# EAGLE board General IO (EAGLE 7.4.0)
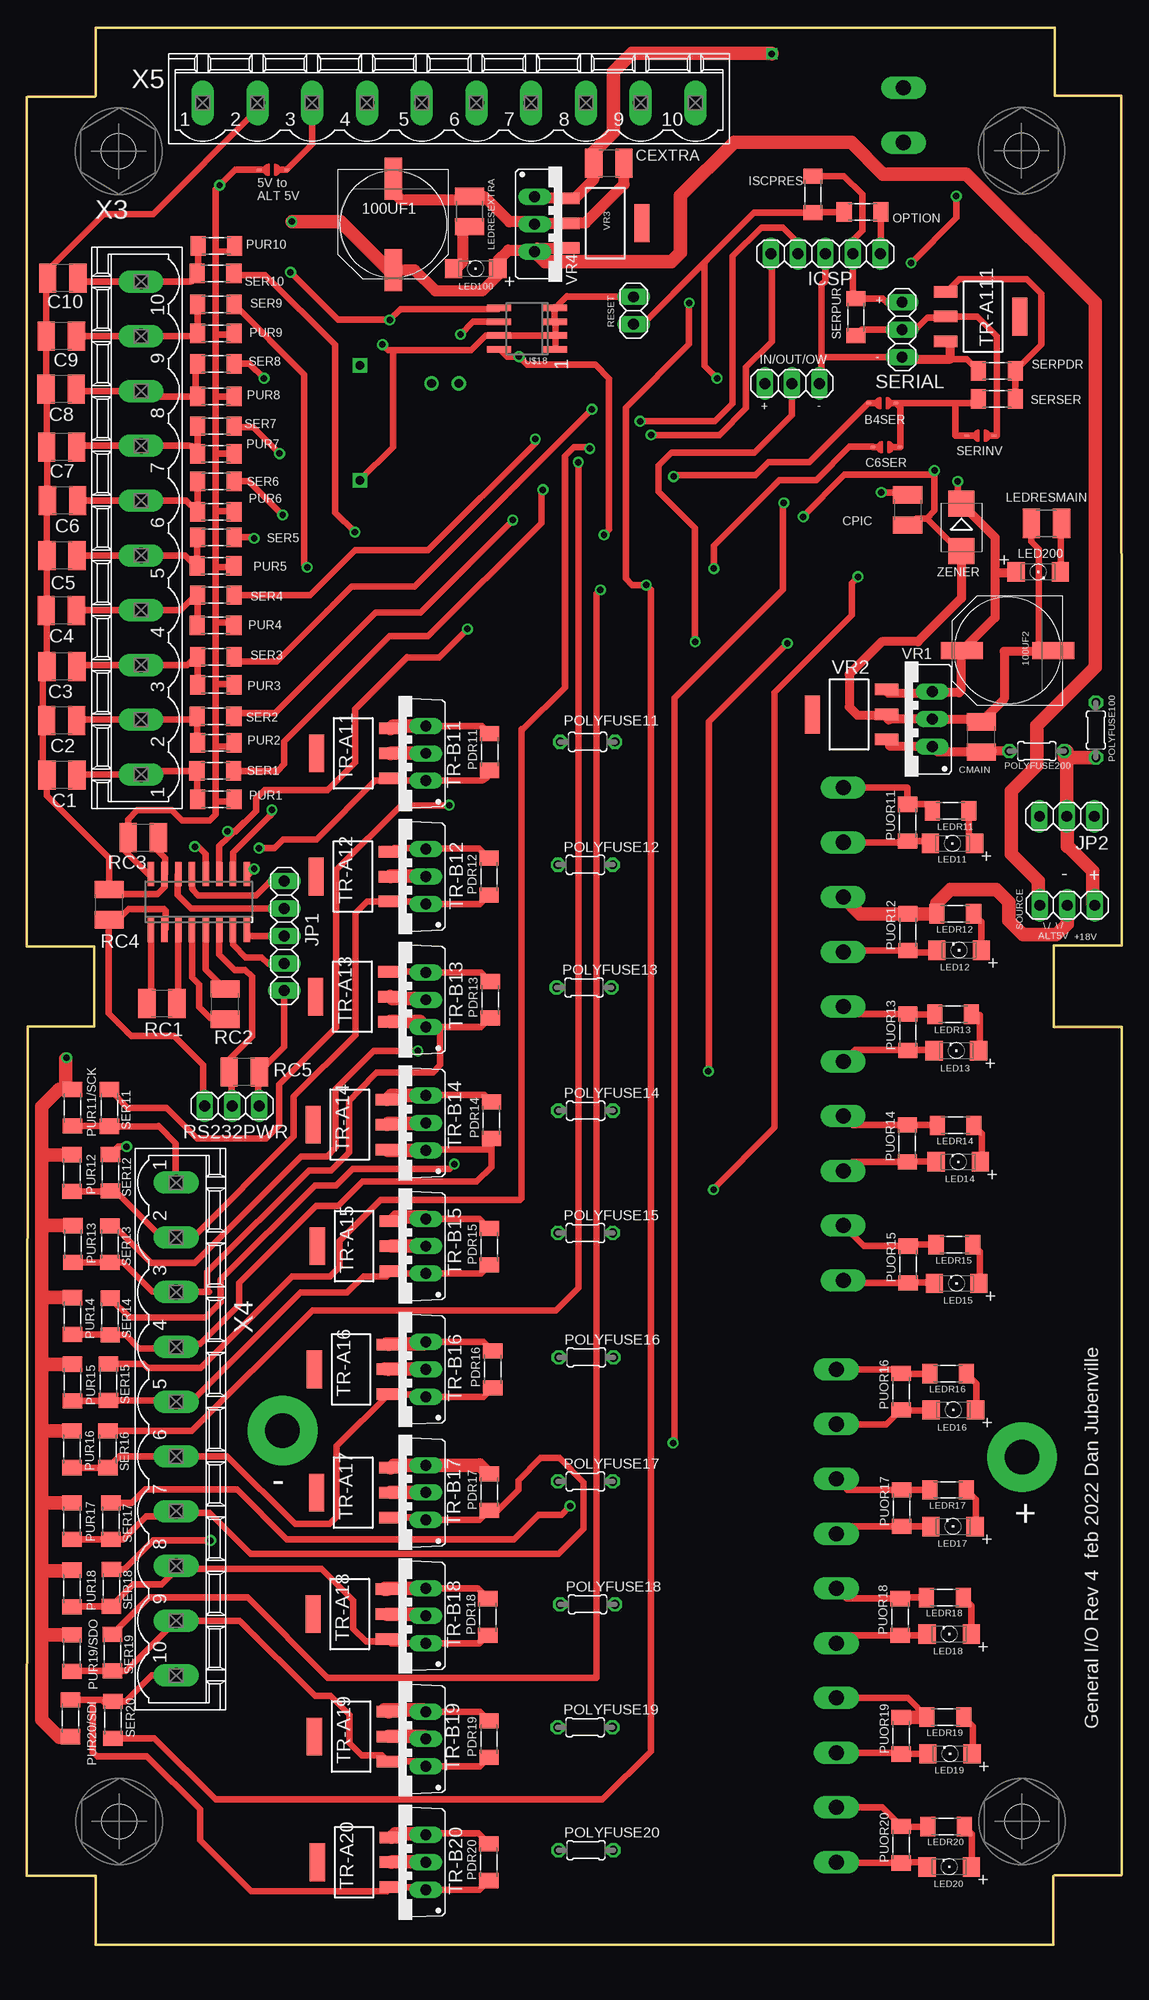
[diagram p1: board, top side]
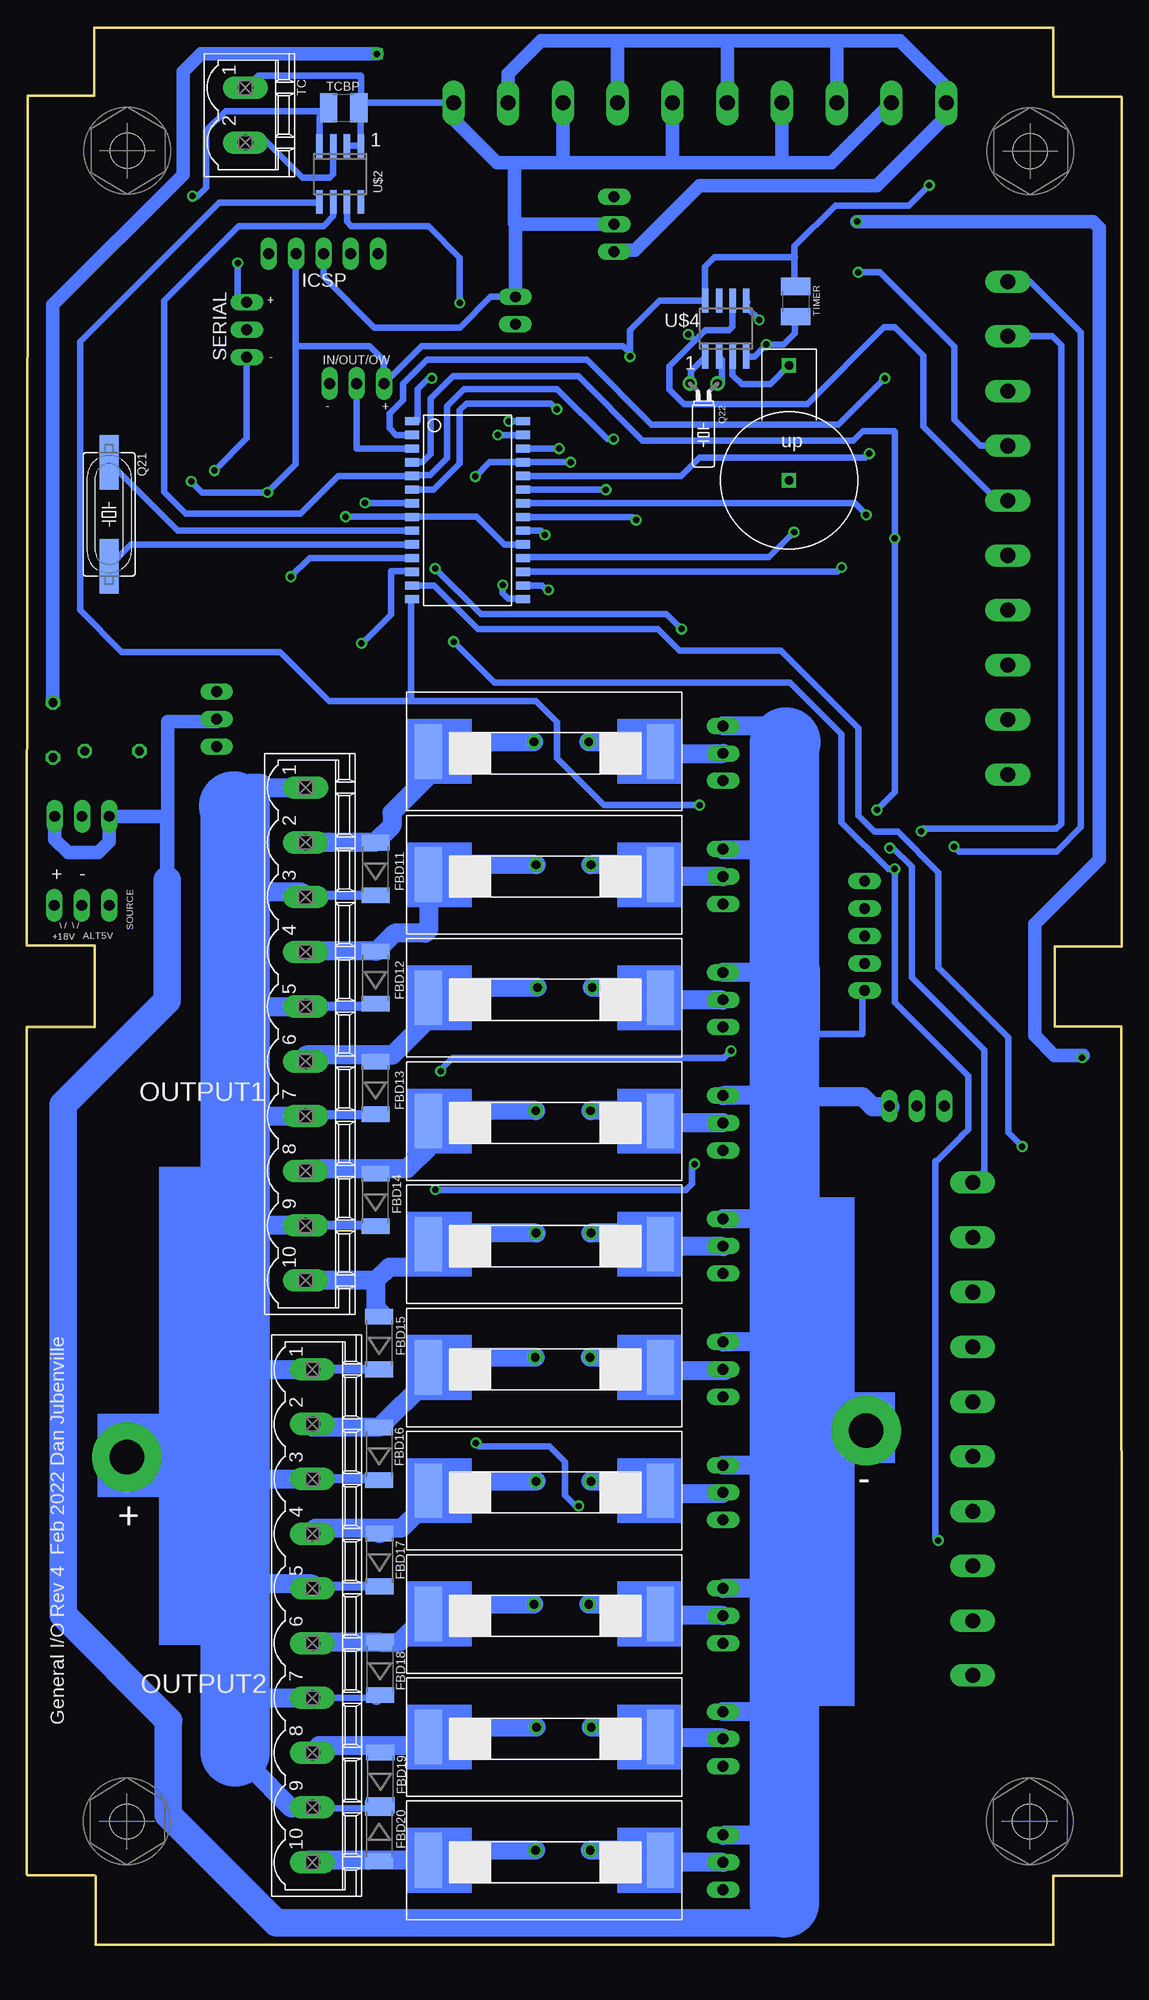
[diagram p2: board, bottom side, seen from below]

Size 101.6 x 177.83 mm. Coordinates in mm from the lower left corner, seen from the top.
Outline: 6.38,0 6.38,6.38 0,6.38 0.08,85.17 6.25,85.17 6.25,92.61 0,92.61 0,171.37 0.08,171.45 6.3,171.45 6.38,171.53 6.38,177.82 95.38,177.82 95.38,171.68 95.35,171.53 101.52,171.53 101.55,165.43 101.6,92.71 95.3,92.71 95.3,85.11 101.6,85.11 101.6,6.53 101.55,6.45 95.35,6.45 95.22,6.33 95.22,0 6.4,0
Copper layers (1*16): Top 0.035mm / dielectric 1.5mm / Bottom 0.035mm
Design rules "default *": minimum track width 15mil, minimum drill 20mil, track to track 15mil, track to pad 15mil, pad to pad 15mil, via to via 15mil, smd to smd 0mil, copper to edge 5mil, drill to drill 5mil, minimum pad ring 10mil, minimum via ring 8mil, stop-mask expansion 4mil, vias tented up to drill 0mil, thermal gap 10mil

## Footprints (pad centres in the part's own frame; a part is rotated, then mirrored left to right if it is on the bottom)
PANASONIC_G = smd 3.9 x 1.6: + 4.25,0; - -4.25,0
BH-401 = drill 0.8 square: P$1 0,0; P$2 0,10.668
C1210 = smd 1.6 x 2.7: 1 -1.4,0; 2 1.4,0
SPLIT_PAD = smd 0.406 x 0.203: P$1 0,0; P$2 2.54,0
SOD87 = smd 1.45 x 2.6: 1 -2.445,0; 2 2.445,0
FUSE = smd 2.54 x 5.08: P$1 2,5.54; P$2 23.54,5.54
SO-28W = smd 0.762 x 1.27: 1 -7.62,-5.207; 2 -6.35,-5.207; 3 -5.08,-5.207; 4 -3.81,-5.207; 5 -2.54,-5.207; 6 -1.27,-5.207; 7 0,-5.207; 8 1.27,-5.207; 9 2.54,-5.207; 10 3.81,-5.207; 11 5.08,-5.207; 12 6.35,-5.207; 13 7.62,-5.207; 14 8.89,-5.207; 15 8.89,5.08; 16 7.62,5.08; 17 6.35,5.08; 18 5.08,5.08; 19 3.81,5.08; 20 2.54,5.08; 21 1.27,5.08; 22 0,5.08; 23 -1.27,5.08; 24 -2.54,5.08; 25 -3.81,5.08; 26 -5.08,5.08; 27 -6.35,5.08; 28 -7.62,5.08
1X05 = drill 1.016 long: 1 -5.08,0; 2 -2.54,0; 3 0,0; 4 2.54,0; 5 5.08,0
1X03 = drill 1.016 long: 1 -2.54,0; 2 0,0; 3 2.54,0
M1406 = smd 1.4 x 1.8: 1 -1.7,0; 2 1.7,0
1206 = smd 1.6 x 1.803: + -1.422,0; - 2.692,0
R1210 = smd 1.6 x 2.7: 1 -1.4,0; 2 1.4,0
MSTBV10 = drill 1.397 long: 1 -22.86,0; 2 -17.78,0; 3 -12.7,0; 4 -7.62,0; 5 -2.54,0; 6 2.54,0; 7 7.62,0; 8 12.7,0; 9 17.78,0; 10 22.86,0
0204/5 = drill 0.813 octagon: 1 -2.54,0; 2 2.54,0
SM49 = smd 5.08 x 1.778: 1 -4.826,0; 2 4.826,0
TC26H = drill 0.813: 1 -1.27,0; 2 1.27,0
1X02 = drill 1.016 long: 1 -1.27,0; 2 1.27,0
MSTBV2 = drill 1.397 long: 1 -2.54,0; 2 2.54,0
SOT223R_INFINEON = smd 1.067 x 2.184: 1 -2.311,-3.479; 2 0,-3.48; 3 2.312,-3.48 | smd 3.5 x 1.4: 4 0,3.404
TO220BV = drill 1.016 long: D 0,-2.54; G -2.54,-2.54; S 2.54,-2.54
SO16 = smd 0.6 x 2.2: 1 -4.445,-2.6; 2 -3.175,-2.6; 3 -1.905,-2.6; 4 -0.635,-2.6; 5 0.635,-2.6; 6 1.905,-2.6; 7 3.175,-2.6; 8 4.445,-2.6; 9 4.445,2.6; 10 3.175,2.6; 11 1.905,2.6; 12 0.635,2.6; 13 -0.635,2.6; 14 -1.905,2.6; 15 -3.175,2.6; 16 -4.445,2.6
SO08 = smd 0.6 x 2.2: 1 -1.905,-2.6; 2 -0.635,-2.6; 3 0.635,-2.6; 4 1.905,-2.6; 5 1.905,2.6; 6 0.635,2.6; 7 -0.635,2.6; 8 -1.905,2.6
SCREW = hole 3.2: 0,0
TO220S = drill 1.016 long: 1 -2.54,-2.54; 2 0,-2.54; 3 2.54,-2.54
SMB = smd 2.4 x 2.4: A 2.2,0; C -2.2,0

## Placement (x,y rotation side)
100UF1  Extra power  [PANASONIC_G]  33.99,159.59 270 top
100UF2  Main Power  [PANASONIC_G]  90.98,120.04 180 top
BAT1  BH-401  [BH-401]  30.89,146.51 180 bottom
C1  [C1210]  3.25,108.51 180 top
C2  [C1210]  3.23,113.56 180 top
C3  [C1210]  3.25,118.57 180 top
C4  [C1210]  3.2,123.75 180 top
C5  [C1210]  3.25,128.85 180 top
C6  [C1210]  3.3,133.96 180 top
C6SER  SPLIT_PAD  [SPLIT_PAD]  78.49,138.91 0 top
C7  [C1210]  3.23,138.91 180 top
C8  [C1210]  3.17,144.3 180 top
C9  [C1210]  3.2,149.22 180 top
C10  [C1210]  3.33,154.58 180 top
CEXTRA  .1uf Extra power  [C1210]  54,165.28 0 top
CMAIN  .1uf main  [C1210]  88.54,112.04 90 top
CPIC  .1uf PIC Bypass  [C1210]  81.71,133.1 270 top
FBD11  [SOD87]  69.27,99.8 90 bottom
FBD12  [SOD87]  69.27,89.71 90 bottom
FBD13  [SOD87]  69.27,79.48 90 bottom
FBD14  [SOD87]  69.27,69.09 90 bottom
FBD15  [SOD87]  68.91,55.8 90 bottom
FBD16  [SOD87]  68.91,45.54 90 bottom
FBD17  [SOD87]  68.88,35.69 90 bottom
FBD18  [SOD87]  68.83,25.6 90 bottom
FBD19  [SOD87]  68.81,15.37 90 bottom
FBD20  [SOD87]  68.91,10.21 270 bottom
FUSE9  FUSE(SM)  [FUSE]  40.82,24.79 180 bottom
FUSE11  FUSE(SM)  [FUSE]  40.82,116.23 180 bottom
FUSE12  FUSE(SM)  [FUSE]  40.82,104.8 180 bottom
FUSE13  FUSE(SM)  [FUSE]  40.82,93.37 180 bottom
FUSE14  FUSE(SM)  [FUSE]  40.82,81.94 180 bottom
FUSE15  FUSE(SM)  [FUSE]  40.82,70.51 180 bottom
FUSE16  FUSE(SM)  [FUSE]  40.82,59.08 180 bottom
FUSE17  FUSE(SM)  [FUSE]  40.82,47.65 180 bottom
FUSE18  FUSE(SM)  [FUSE]  40.82,36.22 180 bottom
FUSE20  FUSE(SM)  [FUSE]  40.82,13.36 180 bottom
IC1  PIC18F2580  [SO-28W]  60.66,133.71 270 bottom
ICSP  [1X05]  74.09,156.87 180 top
IN/OUT/OW  [1X03]  70.99,144.83 180 top
ISCPRES  10k  [M1406]  72.92,162.36 90 top
JP1  [1X05]  23.88,93.57 270 top
JP2  [1X03]  96.49,104.67 180 top
LED11  [1206]  86.51,102.16 180 top
LED12  [1206]  87.12,92.25 180 top
LED13  [1206]  86.87,82.93 180 top
LED14  [1206]  87.05,72.62 180 top
LED15  [1206]  86.89,61.34 180 top
LED16  [1206]  86.59,49.61 180 top
LED17  [1206]  86.56,38.79 180 top
LED18  [1206]  86.21,28.8 180 top
LED19  [1206]  86.28,17.7 180 top
LED20  [1206]  86.21,7.21 180 top
LED100  Extra Power  [1206]  42.27,155.47 180 top
LED200  Main power  [1206]  93.19,127.36 0 top
LEDR11  [M1406]  85.7,105.18 180 top
LEDR12  [M1406]  86.13,95.63 180 top
LEDR13  [M1406]  85.93,86.31 180 top
LEDR14  [M1406]  86.16,76 180 top
LEDR15  [M1406]  86.06,64.92 180 top
LEDR16  [M1406]  85.47,52.98 180 top
LEDR17  [M1406]  85.47,42.19 180 top
LEDR18  [M1406]  85.17,32.21 180 top
LEDR19  [M1406]  85.22,21.11 180 top
LEDR20  [M1406]  85.29,10.97 180 top
LEDRESEXTRA  [R1210]  41.07,160.78 90 top
LEDRESMAIN  [R1210]  94.59,131.85 180 top
OPTION  470  [M1406]  77.52,160.73 0 top
OUTPUT1  MSTBV10  [MSTBV10]  75.74,84.48 270 bottom
OUTPUT2  MSTBV10  [MSTBV10]  75.11,30.51 270 bottom
PDR11  [M1406]  42.93,110.64 90 top
PDR12  [M1406]  42.88,99.09 90 top
PDR13  [M1406]  42.98,87.66 90 top
PDR14  [M1406]  43.1,76.48 90 top
PDR15  [M1406]  42.9,64.74 90 top
PDR16  [M1406]  43.21,53.37 90 top
PDR17  [M1406]  42.9,41.99 90 top
PDR18  [M1406]  42.77,30.4 90 top
PDR19  [M1406]  42.88,19.08 90 top
PDR20  [M1406]  42.85,7.65 90 top
POLYFUSE11  [0204/5]  52.02,111.58 0 top
POLYFUSE12  [0204/5]  51.82,100.18 0 top
POLYFUSE13  [0204/5]  51.69,88.8 0 top
POLYFUSE14  [0204/5]  51.84,77.37 0 top
POLYFUSE15  [0204/5]  51.82,66.01 0 top
POLYFUSE16  [0204/5]  51.89,54.48 0 top
POLYFUSE17  [0204/5]  51.82,42.98 0 top
POLYFUSE18  [0204/5]  52.02,31.57 0 top
POLYFUSE19  [0204/5]  51.79,20.17 0 top
POLYFUSE20  [0204/5]  51.87,8.76 0 top
POLYFUSE100  Extra Power  [0204/5]  99.19,112.67 90 top
POLYFUSE200  Main power  [0204/5]  93.7,110.72 180 top
PUOR11  [M1406]  81.71,104.09 90 top
PUOR12  [M1406]  81.74,93.93 90 top
PUOR13  [M1406]  81.74,84.63 90 top
PUOR14  [M1406]  81.69,74.32 90 top
PUOR15  [M1406]  81.76,63.09 90 top
PUOR16  [M1406]  81.1,51.31 90 top
PUOR17  [M1406]  81.15,40.49 90 top
PUOR18  [M1406]  81,30.4 90 top
PUOR19  [M1406]  81.13,19.38 90 top
PUOR20  [M1406]  81.13,9.27 90 top
PUR1  [M1406]  17.53,106.25 180 top
PUR2  [M1406]  17.53,111.48 180 top
PUR3  [M1406]  17.53,116.87 180 top
PUR4  [M1406]  17.5,122.38 180 top
PUR5  [M1406]  17.5,127.89 180 top
PUR6  [M1406]  17.53,132.92 180 top
PUR7  [M1406]  17.53,138.3 180 top
PUR8  [M1406]  17.53,143.61 0 top
PUR9  [M1406]  17.53,149.48 180 top
PUR10  [M1406]  17.58,157.58 180 top
PUR11/SCK  [M1406]  4.22,77.65 270 top
PUR12  [M1406]  4.19,71.58 270 top
PUR13  [M1406]  4.27,65 270 top
PUR14  [M1406]  4.24,58.32 270 top
PUR15  [M1406]  4.22,52.15 90 top
PUR16  [M1406]  4.19,45.95 90 top
PUR17  [M1406]  4.19,39.29 90 top
PUR18  [M1406]  4.17,33.05 90 top
PUR19/SDO  [M1406]  4.17,27.05 90 top
PUR20/SDI  [M1406]  4.04,21.01 270 top
Q21  20MHz  [SM49]  93.98,132.69 270 bottom
Q22  32.768kHz  [TC26H]  38.81,144.83 180 bottom
RC1  [C1210]  12.52,87.33 0 top
RC2  [C1210]  18.39,87.25 90 top
RC3  [C1210]  10.79,102.72 0 top
RC4  [C1210]  7.62,96.47 90 top
RC5  [C1210]  20.17,80.95 180 top
RESET  [1X02]  56.29,151.59 270 top
RS232PWR  [1X03]  19.02,77.8 180 top
SER1  [M1406]  17.48,108.89 0 top
SER2  [M1406]  17.5,113.94 0 top
SER3  [M1406]  17.53,119.48 0 top
SER4  [M1406]  17.53,125.2 0 top
SER5  [M1406]  17.53,130.56 0 top
SER6  [M1406]  17.53,135.74 0 top
SER7  [M1406]  17.53,140.87 0 top
SER8  [M1406]  17.53,146.66 180 top
SER9  [M1406]  17.53,152.17 0 top
SER10  [M1406]  17.5,155.04 0 top
SER11  [M1406]  7.67,77.62 270 top
SER12  [M1406]  7.75,71.6 270 top
SER13  [M1406]  7.7,64.97 270 top
SER14  [M1406]  7.72,58.27 270 top
SER15  [M1406]  7.57,52.17 270 top
SER16  [M1406]  7.52,45.95 270 top
SER17  [M1406]  7.8,39.29 270 top
SER18  [M1406]  7.82,33.1 270 top
SER19  [M1406]  7.92,27.1 270 top
SER20  [M1406]  7.98,20.85 90 top
SERIAL  [1X03]  81.2,149.81 90 top
SERPDR  [M1406]  89.99,146 180 top
SERPUR  [M1406]  76.91,150.98 270 top
SERSER  [M1406]  89.99,143.38 0 top
SOURCE  [1X03]  96.52,96.42 0 top
TC  Type K  [MSTBV2]  81.33,169.72 270 bottom
TCBP  .1uf TC Bypass  [C1210]  72.21,170.41 0 bottom
TIMER  .1uf Timer Bypass  [C1210]  30.28,152.43 270 bottom
TR-A11  [SOT223R_INFINEON]  30.28,110.52 90 top
TR-A12  [SOT223R_INFINEON]  30.25,99.09 90 top
TR-A13  [SOT223R_INFINEON]  30.2,87.93 90 top
TR-A14  [SOT223R_INFINEON]  29.95,76.07 90 top
TR-A15  [SOT223R_INFINEON]  30.35,64.8 90 top
TR-A16  [SOT223R_INFINEON]  30.07,53.37 90 top
TR-A17  [SOT223R_INFINEON]  30.28,41.94 90 top
TR-A18  [SOT223R_INFINEON]  29.95,30.66 90 top
TR-A19  [SOT223R_INFINEON]  30.07,19.3 90 top
TR-A20  [SOT223R_INFINEON]  30.35,7.65 90 top
TR-A111  [SOT223R_INFINEON]  88.72,151.03 270 top
TR-B11  [TO220BV]  34.47,110.52 90 top
TR-B12  [TO220BV]  34.47,99.09 90 top
TR-B13  [TO220BV]  34.47,87.66 90 top
TR-B14  [TO220BV]  34.47,76.23 90 top
TR-B15  [TO220BV]  34.47,64.8 90 top
TR-B16  [TO220BV]  34.47,53.37 90 top
TR-B17  [TO220BV]  34.47,41.94 90 top
TR-B18  [TO220BV]  34.47,30.51 90 top
TR-B19  [TO220BV]  34.47,19.08 90 top
TR-B20  [TO220BV]  34.47,7.65 90 top
U$1  MAX232  [SO16]  15.95,96.72 0 top
U$2  MAX6674  [SO08]  72.54,164.26 180 bottom
U$4  M41T00TIMER-I2C  [SO08]  36.75,149.91 0 bottom
U$11  [SCREW]  8.56,11.43 0 top
U$13  [SCREW]  92.33,11.43 0 top
U$14  [SCREW]  92.28,166.42 0 top
U$15  [SCREW]  8.51,166.37 0 top
U$18  FM24C256  [SO08]  46.41,149.91 90 top
U$21  SPLIT_PAD  [SPLIT_PAD]  21.56,164.64 0 top
U$23  SPLIT_PAD  [SPLIT_PAD]  89.74,139.98 180 top
U$24  SPLIT_PAD  [SPLIT_PAD]  80.62,143 180 top
VR1  Main  [TO220S]  81.46,113.69 90 top
VR2  Main  [SOT223R_INFINEON]  76.28,114.12 90 top
VR3  Extra power  [SOT223R_INFINEON]  53.67,159.69 270 top
VR4  Extra power  [TO220S]  49.66,159.61 270 top
X3  Inputs 1  [MSTBV10]  10.59,131.42 90 top
X4  Inputs 2  [MSTBV10]  13.84,47.83 270 top
X5  Extra power  [MSTBV10]  39.17,170.87 0 top
ZENER  5.1V  [SMB]  86.71,131.48 270 top

## Tracks (layer width: path | path; a pad name or v marks a point on that pad's centre or on a via)
$N199  (via drill 0.6)
  Top 0.61: SER20.1 11.81,19.15 17.5,13.46 53.42,13.46 57.89,17.93 57.89,125.7 v57.45,126.14 56.16,126.14 55.58,126.72 55.58,142.6 61.44,148.46 v61.44,152.3
  Bottom 0.61: IC1.15 55.58,124.87 56.95,124.87 57.45,125.37 v57.45,126.14 | U$2.7 71.91,159.82 71.5,159.41 64.34,159.41 61.44,156.51 v61.44,152.3
+5V  (via drill 0.6)
  Top 0.61: U$18.8 43.84,148.01 44.53,147.32 v45.64,147.32 46.41,146.56 52.73,146.56 54.03,145.26 54.03,131.27 v53.54,130.78 | ZENER.C 86.36,134.03 v86.36,135.74 | 81.49,134.72 CPIC.1 81.64,134.57 81.64,134.7 79.3,134.7 v79.27,134.72 | 17.53,106.05 17.53,104.83 16.97,104.27 14.4,104.27 13.44,105.23 10.24,105.23 9.39,104.39 RC3.1 8.94,102.26 8.94,101.65 11.27,99.32 U$1.16 | 17.53,106.05 17.53,111.15 | 17.53,111.15 17.53,116.94 | 17.53,116.94 17.53,122.66 | 17.53,122.66 17.53,127.81 | 17.53,127.81 17.53,132.99 | 17.53,132.99 17.53,138.3 | 17.53,138.3 17.53,143.61 | 17.53,143.61 17.53,149.38 | 17.53,149.38 17.53,157.05 | 17.53,157.05 19.28,157.05 PUR10.1 | PUR2.1 18.9,111.15 17.53,111.15 | PUR3.1 19.15,116.94 17.53,116.94 | PUR4.1 18.92,122.66 17.53,122.66 | PUR5.1 19.12,127.81 17.53,127.81 | PUR6.1 19.15,132.99 17.53,132.99 | PUR7.1 17.53,138.3 | PUR8.2 17.53,143.61 | PUR9.1 19.12,149.38 17.53,149.38 | VR2.3 79.93,116.26 79.93,116.08 | PUR1.1 19.02,106.05 17.53,106.05 | v82.04,156.01 86.23,160.2 v86.23,162.2 | SERIAL.3 79.73,152.35 79.4,152.68 SERPUR.1 76.63,152.96 ICSP.2 76.73,156.97 76.73,158.22 77.5,158.98 77.5,162.38 75.82,164.06 ISCPRES.2 | 17.53,157.05 17.53,162.87 v17.88,163.22 19.3,164.64 21.95,164.64
  Top 0.813: 84.15,116.08 84.2,116.08 | 84.15,116.08 VR1.3 84.1,116.13 86.49,116.13 86.64,116.28 86.64,120.04 100UF2.+ 86.77,120.04 89.81,123.09 89.81,127.25 | 84.15,116.08 79.93,116.08 | ZENER.C 89.81,130.57 89.81,127.25 | LED200.+ 91.67,127.25 89.81,127.25
  Bottom 0.61: TIMER.1 30.36,153.75 30.38,153.75 30.38,156.59 | 30.38,156.59 30.33,156.54 37.8,156.54 38.68,155.65 38.68,152.54 U$4.8 42.93,152.5 45.67,149.76 45.67,147.29 | 55.6,131.14 IC1.20 53.92,131.17 v53.54,130.78 | 30.38,156.59 30.38,157.56 26.59,161.34 19.76,161.34 v17.88,163.22 | SERIAL.3 81.25,152.35 81.31,152.3 82.04,153.03 v82.04,156.01 | 45.67,147.29 45.67,147.24 | 45.67,147.29 v45.64,147.32 45.64,147.62 46.3,148.28 65,148.28 IN/OUT/OW.3 68.53,144.91 68.53,146.99 69.83,148.28 76.66,148.28 | v86.36,135.74 85.34,134.72 v79.27,134.72 79.3,134.7 79.3,134.72 76.66,137.36 76.66,148.28 | 76.66,148.28 76.66,156.84 ICSP.2 | 74.06,169.97 TCBP.1 | 74.06,169.97 74.19,170.1 83.16,170.1 84.96,168.3 84.96,162.99 85.75,162.2 v86.23,162.2 | U$2.4 74.45,169.57 74.06,169.97
+18V
  Top 1.27: 98.93,96.42 98.98,96.37 99.03,96.42 SOURCE.3 98.88,96.6 98.88,99.59 96.62,101.85 96.52,101.85 96.52,104.67 JP2.2 96.5,110.72 POLYFUSE200.1 96.24,110.13 POLYFUSE100.1
ALT5V  (via drill 0.6)
  Top 0.61: 37.9,153.42 37.9,153.47 35.89,155.47 33.48,155.47 | 1.37,28.68 1.45,28.75 | 1.37,34.75 1.22,34.75 1.22,34.74 | 1.37,41.05 1.42,41.05 1.48,40.99 | 1.37,47.68 1.4,47.65 | 1.37,53.9 1.35,53.9 1.4,53.85 | 1.37,60.02 1.42,60.02 | 1.37,66.7 1.42,66.7 | 1.37,73.3 1.42,73.3 1.45,73.28 | VR3.3 49,157.38 | U$21.P$2 26.47,167 X5.3
  Top 0.813: v3.68,82.27 3.58,82.17 | 3.58,79.53 3.76,79.35 PUR11/SCK.1
  Top 1.016: 49,157.38 47.37,157.38 47.12,157.12 VR4.3 47.17,157.07 47.22,157.12 47.14,157.2 44.68,157.2 43.69,156.21 LED100.+ 43.69,155.3 43.92,155.07 42.27,153.42 37.9,153.42 35.98,155.34 100UF1.+
  Top 1.27: 33.48,155.47 29.11,159.84 v24.59,159.84 | 1.37,34.67 1.37,28.68 1.37,20.85 3,19.23 3.96,19.23 PUR20/SDI.2 | 1.37,34.67 1.37,34.75 1.37,41.05 1.37,47.68 1.37,53.9 1.37,60.02 1.37,66.7 1.37,73.3 1.37,77.75 2.97,79.35 PUR11/SCK.1 | 1.45,28.75 PUR19/SDO.2 | 1.48,40.99 PUR17.2 | 1.4,47.65 PUR16.2 | 1.4,53.85 PUR15.2 | 1.42,60.02 PUR14.1 | 1.42,66.7 PUR13.1 | 1.45,73.28 PUR12.1 | SOURCE.1 93.85,96.55 93.85,98.65 91.31,101.19 91.31,107.01 93.7,109.4 93.7,113.11 99.11,118.52 99.11,152.32 87.17,164.26 79.43,164.26 76.48,167.21 65.63,167.21 60.66,162.23 60.66,156.97 59.82,156.13 48.06,156.13 VR4.3 | 3.58,82.17 3.58,79.53 | PUR18.2 4.09,34.67 1.37,34.67
  Bottom 0.61: 3.61,82.5 3.61,82.35 v3.68,82.27
  Bottom 1.27: 26.47,176.61 20.6,176.61 16.31,172.31 X5.1 16.26,170.87 16.2,170.81 16.2,169.72 | 26.47,176.61 36.6,176.61 | 36.6,176.61 46.79,176.61 | 46.79,176.61 53.92,176.61 56.97,173.56 56.97,170.84 | 56.97,170.84 56.97,170.69 | 56.97,170.84 X5.9 | 26.47,176.61 26.47,176.63 | 26.47,176.61 X5.3 | X5.5 36.6,170.89 36.6,176.61 | 46.79,176.61 46.79,176.63 | 46.79,176.61 X5.7 | 16.2,169.54 16.2,169.72 | v24.59,159.84 2.67,159.84 2.11,159.28 2.11,100.66 8.1,94.67 8.1,84.33 6.27,82.5 3.61,82.5 | VR4.3 46.99,157.2 45.19,157.2 39.22,163.17 22.76,163.17 16.2,169.72
GND  (via drill 0.6, 3.2 pad 6.45)
  Top 0.381: U$1.15 12.78,98.48
  Top 0.406: CPIC.2 81.92,131.7 82.3,132.08 | TR-A111.3 85.34,148.72 85.67,148.39
  Top 0.61: PDR14.2 42.44,78.84 36.93,78.84 | PDR12.2 41.96,101.7 41.93,101.68 36.96,101.68 | U$18.2 49.63,149.28 | U$18.2 U$18.7 42.55,149.28 41.2,147.93 33.96,147.93 | U$18.1 49.02,148.02 49.02,149.29 | 49.02,149.29 U$18.2 | 49.02,149.29 49.02,150.53 U$18.3 48.95,150.61 48.95,151.88 | 48.95,151.88 48.95,151.89 | 48.95,151.88 U$18.4 50.12,152.93 50.2,152.86 RESET.1 | 82.3,132.08 82.53,132.31 83.49,132.31 | 83.49,132.31 84.2,133.02 84.2,136.3 84.15,136.35 | 73.74,147.27 SERIAL.1 | 93.19,131.78 93.29,131.88 | 93.19,131.78 LEDRESMAIN.2 | 73.53,143.97 IN/OUT/OW.1 73.74,145.03 73.74,147.27 | 37.36,78.72 37.06,78.72 TR-B14.S 36.98,78.79 36.88,78.79 | TR-A14.3 33.76,78.72 | TR-B15.S 36.93,67.41 | 34.14,67.41 TR-A15.3 | 36.98,55.88 TR-B16.S 42.37,55.91 PDR16.2 | TR-A16.3 33.76,55.88 | 33.76,44.22 TR-A17.3 | TR-A17.3 | 36.75,44.22 TR-B17.S 37.06,44.53 | 33.35,21.69 33.48,21.69 TR-A19.3 | TR-B19.S 36.93,21.69 | 36.91,10.26 36.93,10.26 TR-B20.S | 36.83,21.59 36.98,21.59 TR-B19.S | 41.88,32.99 PDR18.2 | 42.01,44.53 42.06,44.48 | 36.7,67.28 36.96,67.28 TR-B15.S | TR-B13.S 36.73,90.19 | PDR13.2 42.14,90.19 TR-B13.S | TR-A12.3 34.06,101.73 37.11,101.73 TR-B12.S 36.96,101.68 | 36.96,101.68 36.93,101.68 | TR-B13.S 37.03,90.22 37.03,90.27 33.71,90.27 TR-A13.3 | RS232PWR.1 21.46,77.9 21.46,80.84 RC5.1 23.88,83.26 JP1.5 | PDR20.2 41.88,10.31 36.88,10.31 | PDR19.2 42.03,21.61 TR-B19.S | 41.88,32.99 41.91,32.99 42.6,32.31 | v72.03,132.46 71.98,132.46 75.87,136.35 84.15,136.35 | 93.19,131.78 93.19,130.15 93.9,129.44 93.9,120.75 94.67,119.99 | 12.78,98.48 12.78,98.12 12.12,97.46 8.03,97.46 RC4.2 7.62,100.81 1.85,106.58 C1.2 1.85,108.84 1.45,108.84
  Top 0.61: C5.2 1.45,128.85 | 1.45,113.56 1.45,108.84 | 1.37,108.84 1.45,108.84 | C2.2 1.45,113.56 | 1.45,113.56 1.45,118.82 1.85,118.82 C3.2 | 1.85,118.62 C3.2 | C5.2 1.85,133.91 C6.2 1.9,138.84 C7.2 1.83,144.25 C8.2 1.77,149.2 C9.2 1.8,154.46 C10.2 1.93,154.94 1.5,154.94 7.11,160.55 11.71,160.55 21.41,170.26 21.41,170.84 X5.2 | 1.5,123.72 1.47,123.7 1.8,123.7 | 83.49,132.31 86.52,129.28 ZENER.A | 79.88,113.72 79.98,113.61 | VR2.2 79.96,113.92 79.96,113.72 | 73.74,147.27 73.74,154 74.07,154.33 74.04,154.33 74.09,154.38 ICSP.3 | RC3.2 12.2,101.44 12.83,100.81 12.83,99.37 U$1.15 | C5.2 1.85,123.7 | 1.85,123.7 C3.2 | 1.8,123.7 C4.2 | 1.8,123.7 1.85,123.7 | 33.96,147.93 33.5,147.93 v32.99,148.44 | BAT1.P$2 33.96,138.91 33.96,147.93 | PDR11.2 42.21,113.06 TR-B11.S | PDR15.2 42.01,67.33 TR-B15.S | 41.88,32.99 41.83,33.05 TR-B18.S | 84.15,136.35 84.2,136.4 v84.2,136.75 | 85.7,147.09 87.2,147.09 SERPDR.2
  Top 0.813: 85.67,147.09 85.67,148.39 | 85.67,147.09 85.7,147.09 | SERIAL.1 81.38,147.09 85.67,147.09 | 79.93,113.61 79.98,113.61 | 79.98,113.61 | 84.02,113.72 84.15,113.72 | 84.02,113.72 VR1.2 88.29,113.69 CMAIN.2 90.68,115.57 90.68,119.97 90.7,119.99 94.67,119.99 94.67,120.07 94.82,119.91 95.17,119.91 95.17,119.98 100UF2.- | 84.02,113.72 79.96,113.72 79.88,113.72 | ZENER.A 86.71,124.91 82.68,120.88 79.32,120.88 76.3,117.86 76.3,114.81 77.06,114.05 79.55,114.05 79.98,113.61
  Top 1.016: CEXTRA.2 55.4,163.3 51.84,159.74 49.76,159.74 49.73,159.72 49.76,159.69 VR3.2 47.07,159.69 47.04,159.66 47.09,159.61 VR4.2 47.27,159.61 47.3,159.64 47.12,159.82 44.76,159.82 42.39,162.18 LEDRESEXTRA.2 41.07,162.15 40.77,161.85 34.77,161.85 33.98,162.64 100UF1.-
  Top 1.27: PDR17.2 42.85,43.69 42.06,44.48 | TR-A20.3 34.16,10.29 36.91,10.29 TR-B20.S 36.88,10.31 36.73,10.31 | 33.4,21.77 33.12,21.77 | 33.4,21.77 TR-A19.3 | 36.98,21.59 36.8,21.77 33.4,21.77 | TR-B19.S 36.85,21.61 | 33.76,44.22 34.01,44.48 TR-B17.S 41.96,44.48 42.01,44.53 | TR-A18.3 33.17,32.97 33.25,33.05 TR-B18.S | TR-A18.3 | 36.91,78.84 36.93,78.84 TR-B14.S | TR-B14.S 37.13,78.77 | TR-A14.3 33.81,78.77 TR-B14.S | 34.14,67.41 34.24,67.51 36.91,67.51 36.91,67.44 TR-B15.S 37.01,67.51 | 33.5,55.73 33.38,55.73 | 33.5,55.73 TR-A16.3 | TR-B16.S 36.83,55.73 33.5,55.73 | TR-B16.S 37.06,55.96 | TR-B16.S 36.98,55.91 | TR-A11.3 33.98,113.06 TR-B11.S
  Bottom 0.61: 70.59,170.18 TCBP.2 70.81,170.69 70.64,170.87 X5.10 | TIMER.2 30.3,151.05 30.35,151.05 30.35,149.48 31.39,148.44 v32.99,148.44 34.12,147.31 U$4.4 | v72.03,132.46 65.89,132.46 | IC1.19 55.6,129.87 57.28,129.87 59.87,132.46 65.89,132.46 | 65.89,132.46 IC1.8 | 31.93,78.77 31.93,78.64 | 70.59,170.18 70.59,173.35 80.16,173.35 81.33,172.19 | 81.33,172.19 81.41,172.11 | TC.1 81.33,172.19 | JP1.5 24.11,88.49 24.11,84.48 29.72,84.48 29.72,84.66 31.24,84.66 31.24,84.63 | 70.59,170.18 70.64,170.13 U$2.1 U$2.2 | 56.36,159.69 56.29,159.61 56.26,159.61 | ICSP.3 74.09,154.71 69.39,150.01 61.42,150.01 58.57,152.86 RESET.1 | 33.48,101.27 33.93,101.73 36.6,101.73 | 31.32,111.43 31.11,111.23 31.11,103.96 | 30.89,100.71 31.32,100.28 31.32,99.21 | 31.24,101.55 31.85,100.94 34.24,100.94 34.92,101.62 TR-B12.S | v84.2,136.75 81.2,139.75 SERIAL.1 | 88.62,98.73 88.62,98.63 88.59,98.6
  Bottom 1.27: X5.2 26.95,165.3 31.57,165.3 | 31.57,165.3 41.68,165.3 | 56.36,165.3 51.82,165.3 | 56.36,165.3 57.96,165.3 62,169.34 62,170.76 61.9,170.87 | 61.9,170.87 61.87,170.89 | X5.10 61.9,170.87 | X5.4 31.55,165.33 31.57,165.3 | 41.68,165.3 41.68,165.38 41.71,165.41 X5.6 | X5.8 51.87,165.35 51.82,165.3 | 51.82,165.3 41.68,165.3 | 56.36,165.3 56.36,159.69 | VR4.2 56.26,159.61 56.31,159.56 56.29,159.54 RESET.1 | 83.97,113.56 83.97,113.67 VR1.2 84,113.44 CMAIN.2 88.54,98.73 88.62,98.73 88.62,104.67 JP2.3 93.95,102.31 94.97,101.3 97.77,101.3 99.01,102.54 99.01,104.65 JP2.1 | 36.96,112.93 36.96,113 TR-B11.S | 31.24,101.6 31.22,101.58 | 31.22,90.19 31.24,90.19 | 31.93,78.77 31.24,78.77 31.24,78.94 31.27,78.94 | 31.27,67.54 31.27,67.33 | 31.27,55.91 31.27,56.06 31.32,56.06 | 31.32,44.48 31.27,44.48 | 31.27,33.05 31.27,33.2 31.32,33.2 | 37.11,10.13 37.01,10.13 TR-B20.S | 31.24,101.55 31.24,101.6 | 37.03,101.55 37.01,101.55 TR-B12.S | 33.78,101.55 33.78,101.45 33.66,101.45 33.48,101.27 | 31.93,78.64 31.9,78.66 | 21.44,77.75 21.51,77.75 RS232PWR.1 | 88.59,98.78 88.59,99.31 | 31.11,103.96 31.11,99.24 31.34,99.47 | 30.89,100.71 30.89,102.49 31.22,102.16 31.22,101.62 31.24,101.6 | 31.65,113.06 31.19,112.6 31.19,111.56
  Bottom 1.778: 31.24,90.19 TR-B13.S | 31.93,78.77 TR-B14.S | 31.27,67.33 TR-B15.S | 31.27,55.91 TR-B16.S | 31.32,44.48 TR-B17.S | 31.27,33.05 TR-B18.S | 31.32,21.61 TR-B19.S | 31.32,10.13 37.01,10.13 | 33.78,101.55 37.01,101.55 | 31.9,78.66 24.08,78.66 23.16,77.75 21.51,77.75 | 31.65,113.06 TR-B11.S | 32.44,2.03 31.32,3.15 31.32,3.86 31.32,11.48 | v23.72,47.7 31.09,47.7 arc-90 31.32,47.47
  Bottom 2.54: 31.32,56.06 31.32,47.47 31.32,44.48 | 31.27,44.48 31.27,33.2 | 31.32,33.2 31.32,21.61 31.32,11.48 31.32,10.13 | 32.44,2.03 78.49,2.03 88.49,12.04 88.49,20.73 88.44,20.78 98.25,30.58 98.25,77.95 88.59,87.61 88.59,98.6 88.59,98.78
  Bottom 6.452: 31.24,90.19 31.24,84.63 | 31.27,78.94 31.27,67.54 31.27,56.06 | 31.19,111.56 31.32,111.43 31.32,99.21 31.32,47.47 31.32,3.86
N$1
  Top 1.27: TR-A17.2 TR-B17.D
  Bottom 0.61: 42.95,42.11 43.81,42.98
  Bottom 1.27: 42.95,42.11 FUSE17.P$1 42.54,41.83 | TR-B17.D 37.11,41.83
  Bottom 1.778: 43.81,42.98 44.04,42.98 POLYFUSE17.1 | 37.11,41.83 42.54,41.83
N$2
  Top 1.27: TR-A19.2 36.78,19.3 TR-B19.D
  Bottom 1.27: 43.84,20.17 42.92,19.25 FUSE9.P$1 42.74,19.18 | TR-B19.D 37.01,19.18
  Bottom 1.778: 43.84,20.17 POLYFUSE19.1 | 37.01,19.18 42.74,19.18
N$3
  Top 0.61: PUR18.1 4.22,31.4 SER18.2 9.85,33.43 12.5,33.43 13.61,34.54 X4.8 14.1,34.87 27.36,34.87 30.28,31.95 30.28,29.31 31.45,28.14 33.22,28.14 TR-A18.1 33.81,27.96 TR-B18.G 37.03,27.94 42.01,27.94 PDR18.1
N$4
  Top 0.61: 81.05,49.55 83.85,49.55 | PUOR16.1 79.75,48.26 75.08,48.26 | 75.01,48.26 75.08,48.26 | 75.08,48.26 OUTPUT2.2
  Top 1.27: 80.9,49.55 81.05,49.55 PUOR16.1 | 83.85,49.55 LED16.-
  Bottom 1.27: OUTPUT2.2 75.11,48.23 75.23,48.11 75.11,47.99
  Bottom 1.778: 75.11,47.99 FBD16.2 64.36,52.54 FUSE16.P$2 arc90 63.41,54.48 POLYFUSE16.2
N$5
  Top 0.61: LED17.- PUOR17.1 75.77,38.79 OUTPUT2.4
  Bottom 1.27: 63.27,42.98 63.86,42.39 63.86,42.34 64.36,41.84 | 64.36,41.84 64.41,41.78 | 64.36,41.84 FUSE17.P$2 64.36,41.13 | 75.36,38.12 75.39,38.1 | 75.36,38.12 OUTPUT2.4 | 74.85,38.63 75.36,38.12
  Bottom 1.778: POLYFUSE17.2 63.27,42.98 | 64.36,41.13 66.85,38.63 68.89,38.63 | 68.89,38.63 74.85,38.63 | 68.89,38.63 FBD17.2
N$6
  Top 1.27: 33.5,53.42 33.22,53.42 | TR-A16.2 33.5,53.42 | TR-B16.D 36.96,53.42 33.5,53.42
  Bottom 1.27: 42.82,53.46 42.8,53.44 | 42.82,53.46 FUSE16.P$1 | 42.82,53.46 43.84,54.48 | 36.83,53.24 36.88,53.24 TR-B16.D | 42.6,53.24 42.82,53.46
  Bottom 1.778: 43.84,54.48 POLYFUSE16.1 | 36.88,53.24 42.6,53.24
N$7
  Top 1.27: TR-A18.2 33.45,30.63 36.88,30.63 TR-B18.D
  Bottom 1.27: 42.82,30.61 42.95,30.48 44.04,31.57 | 42.82,30.61 FUSE18.P$1 | TR-B18.D 37.01,30.53 | 42.73,30.53 42.82,30.61
  Bottom 1.778: 44.04,31.57 POLYFUSE18.1 | 37.01,30.53 42.73,30.53
N$8  (via drill 0.6)
  Top 0.61: v70.23,133.76 70.43,133.76 | v59.94,46.53 60.1,46.69 60.1,115.65 70.16,125.7 70.16,133.76 v70.23,133.76 | v70.23,133.76 70.23,133.73 | SER17.1 9.73,40.99 10.97,42.24 19.48,42.24 24.11,37.62 45.21,37.62 47.47,39.88 49.58,39.88 v50.39,40.69
  Bottom 0.61: IC1.7 70.18,133.71 v70.23,133.76 | v59.94,46.53 59.64,46.23 53.11,46.23 51.69,44.81 51.69,41.68 50.7,40.69 v50.39,40.69
N$9
  Top 0.61: LED20.- 83.08,7.64 81.2,7.64 | PUOR20.1 75.18,7.57 OUTPUT2.10
  Top 1.27: PUOR20.1 81.2,7.64
  Bottom 0.381: 73.15,7.62 70.1,7.62
  Bottom 0.61: FBD20.2 68.97,7.82 69.9,7.82 | 73.15,7.62 73.18,7.64 OUTPUT2.10
  Bottom 1.27: FUSE20.P$2 64.36,7.64 64.21,7.49 62.94,8.76 | 75.59,7.82 75.72,7.7 75.18,7.7 75.11,7.77 OUTPUT2.10
  Bottom 1.778: POLYFUSE20.2 62.94,8.76 | FUSE20.P$2 69.9,7.82 75.59,7.82
N$10
  Top 0.61: 83.39,28.68 81.03,28.68 | PUOR18.1 75.85,28.7 OUTPUT2.6
  Top 1.27: 81,28.68 PUOR18.1 81.03,28.68 | 83.39,28.68 LED18.-
  Bottom 1.27: 62.81,31.57 63.73,30.66 64.01,30.66 64.06,30.61 64.13,30.68 FUSE18.P$2
  Bottom 1.778: POLYFUSE18.2 62.81,31.57 | FUSE18.P$2 64.71,30.33 64.77,30.33 67.05,28.05 FBD18.2 75.03,28.05 OUTPUT2.6
N$11  (via drill 0.6)
  Top 0.61: v53.21,125.68 52.86,125.32 52.86,24.77 27.91,24.77 20.47,32.21 11.33,32.21 SER19.1
  Bottom 0.61: IC1.16 53.82,126.09 53.39,125.65 53.24,125.65 v53.21,125.68
N$12  (via drill 0.6)
  Top 0.61: SER8.1 19.25,146.69 20.62,146.69 v22,145.31
  Bottom 0.61: IC1.2 67.33,140.06 67.94,140.66 67.94,142.04 66.7,143.28 66.7,144.81 64.49,147.01 49.63,147.01 43.64,141.02 26.29,141.02 v22,145.31
N$13
  Top 0.61: PUOR19.1 83.57,17.68 | OUTPUT2.8 81,17.8
  Top 1.27: 81.1,17.68 PUOR19.1 81,17.8 | 83.57,17.68 LED19.-
  Bottom 1.27: 63.12,20.17 64.04,19.25 FUSE9.P$2 64.36,18.93 64.82,18.47 | OUTPUT2.8 75.11,17.86 74.5,18.47 | 68.81,18.47 FBD19.2
  Bottom 1.778: POLYFUSE19.2 63.12,20.17 | 64.82,18.47 68.81,18.47 74.5,18.47
N$14
  Top 1.27: TR-A20.2 33.88,7.7 36.96,7.7 TR-B20.D
  Bottom 1.27: 42.82,7.84 FUSE20.P$1 | 42.82,7.84 43.74,8.76 | TR-B20.D 37.01,7.62 | 42.6,7.62 42.82,7.84
  Bottom 1.778: 43.74,8.76 POLYFUSE20.1 | 37.01,7.62 42.6,7.62
N$15  (via drill 0.6)
  Top 0.61: SER2.2 19.5,114.25 23.04,114.25 32.36,123.57 36.5,123.57 v45.09,132.16
  Bottom 0.61: v45.09,132.16 45.36,132.44 IC1.21
N$16
  Top 0.61: 84.2,92.02 81.74,92.02 PUOR12.1 75.87,92.23 OUTPUT1.4
  Top 1.27: 84.2,92.02 LED12.-
  Bottom 1.27: 63.32,100.18 63.93,99.57 63.93,99.54 64.26,99.21 64.31,99.26 FUSE12.P$2 | 64.36,94.09 64.62,93.83 | 69.16,92.16 FBD12.2 | 76.18,92.16 76.28,92.25 76,92.25 75.79,92.05 OUTPUT1.4
  Bottom 1.778: POLYFUSE12.2 63.32,100.18 | FUSE12.P$2 64.36,94.09 | 64.62,93.83 67.49,93.83 69.16,92.16 | FBD12.2 76.18,92.16
N$17
  Top 1.27: 37.13,64.8 TR-B15.D TR-A15.2
  Bottom 1.27: 42.82,64.99 FUSE15.P$1 | 42.82,64.99 43.84,66.02 | TR-B15.D 37.01,64.77 | 42.6,64.77 42.82,64.99
  Bottom 1.778: 43.84,66.02 POLYFUSE15.1 | 37.01,64.77 42.6,64.77
N$18
  Top 0.61: 81.76,61.44 84.1,61.44 | PUOR15.1 75.97,61.39 OUTPUT1.10
  Top 1.27: PUOR15.1 81.76,61.44 | 84.1,61.44 LED15.-
  Bottom 1.27: 62.99,66.02 64.21,64.8 64.36,64.94 FUSE15.P$2 64.36,63.78 65.3,62.84 | 75.51,61.59 75.54,61.62 OUTPUT1.10 | 68.71,58.55 68.91,58.34 FBD15.2
  Bottom 1.778: POLYFUSE15.2 62.99,66.02 | 65.3,62.84 68,62.84 69.24,61.59 | 69.24,61.59 75.51,61.59 | 69.24,61.59 69.24,59.08 68.71,58.55
N$19
  Top 0.61: U$1.7 19.13,93.95 19.15,93.93 19.13,93.9 19.13,92.76 20.3,91.59 21.79,91.59 22.38,91.01 23.88,91.01 JP1.4
N$20
  Top 0.61: PUR17.1 SER17.2 8.92,37.59 11.05,39.73 13.13,39.73 X4.7 13.77,40.06 16.97,40.06 20.78,36.25 49.33,36.25 51.64,38.56 51.64,42.9 49.4,45.14 47.65,45.14 45.59,43.08 45.59,42.19 43.69,40.29 PDR17.1 42.01,39.4 TR-B17.G 36.78,39.62 TR-A17.1
N$21
  Top 1.27: 37.06,76.17 37.24,76.17 | 37.06,76.17 TR-B14.D | TR-A14.2 33.53,76.17 37.06,76.17
  Bottom 1.27: 43.84,77.37 42.87,76.4 FUSE14.P$1 42.64,76.22 | TR-B14.D 36.91,76.22
  Bottom 1.778: 43.84,77.37 POLYFUSE14.1 | TR-B14.D 42.64,76.22
N$22
  Top 0.61: 81.73,72.67 84.3,72.67 | PUOR14.1 76.58,72.62 OUTPUT1.8
  Top 1.27: PUOR14.1 81.73,72.67 | 84.3,72.67 LED14.-
  Bottom 1.27: 62.94,77.37 64.14,76.17 FUSE14.P$2 64.36,73.92 | 75.84,71.78 76.07,71.55 | 75.84,71.78 OUTPUT1.8 | 75.67,71.96 75.84,71.78 | 69.27,71.96 FBD14.2
  Bottom 1.778: POLYFUSE14.2 62.94,77.37 | 64.36,73.92 66.32,71.96 69.27,71.96 75.67,71.96
N$23
  Top 1.27: TR-B13.D 37.06,87.71 37.06,87.76 33.86,87.76 TR-A13.2
  Bottom 1.27: 43.69,88.8 42.82,87.93 FUSE13.P$1 42.62,87.63 | TR-B13.D 37.03,87.63
  Bottom 1.778: 43.69,88.8 POLYFUSE13.1 | 37.03,87.63 42.62,87.63
N$24
  Top 0.61: 81.66,83.01 84.1,83.01 | 81.53,83.01 76.81,83.01 OUTPUT1.6
  Top 1.27: 81.53,83.01 81.66,83.01 PUOR13.1 | 84.1,83.01 LED13.-
  Bottom 1.27: 63.32,88.8 64.29,87.83 FUSE13.P$2 64.36,85.86 | OUTPUT1.6 75.72,81.92 75.79,81.84 76.4,81.84 | 69.27,82.53 FBD13.2
  Bottom 1.778: POLYFUSE13.2 63.32,88.8 | 64.36,85.86 67.69,82.53 69.27,82.53 75.72,82.53 76.4,81.84
N$25
  Top 0.61: PUR15.1 7.54,50.45 SER15.2 13.84,50.47 | 14.43,50.47 13.89,50.47 13.84,50.47 | 37.01,62.13 TR-B15.G | TR-B15.G 34.06,62.26 TR-A15.1 33.35,62 31.22,62 29.72,60.5 25.38,60.5 15.27,50.39 13.64,50.39 X4.5 13.84,50.47 | PDR15.1 42.11,62.26 TR-B15.G
N$26
  Top 0.61: PUR13.2 7.67,63.3 SER13.2 8.91,63.27 11.61,60.58 13.56,60.58 X4.3 16.74,60.53 | PDR13.1 42.14,85.11 38.35,85.11 | 38.35,85.11 TR-B13.G | 16.74,60.53 16.92,60.53 | 38.35,85.11 38.35,81.58 37.67,80.9 32.46,80.9 30.86,79.3 30.86,79.27 29.87,78.28 29.87,73.48 28.22,71.83 26.19,71.83 16.74,62.38 16.74,60.53
  Top 1.27: TR-B13.G 36.5,85.62 TR-A13.1
N$27
  Top 1.27: 37.03,99.11 37.11,99.11 | 37.03,99.11 TR-B12.D | TR-A12.2 33.76,99.11 37.03,99.11
  Bottom 1.27: 42.75,99.39 42.82,99.32 FUSE12.P$1 | 42.75,99.39 43.54,100.18 | TR-B12.D 36.83,99.08 | 42.44,99.08 42.75,99.39
  Bottom 1.778: 43.54,100.18 POLYFUSE12.1 | TR-B12.D 42.44,99.08
N$28
  Top 0.61: PUR14.2 7.67,56.62 SER14.2 9.14,56.57 10.39,55.32 13.49,55.32 X4.4 13.89,55.73 16.08,55.73 19.71,59.36 19.71,61.39 26.82,68.5 28.85,68.5 31.14,70.79 41.73,70.79 43.1,72.16 43.1,73.76 | PDR14.1 43.1,73.76 | TR-A14.1 33.5,73.69 33.58,73.76 43.1,73.76
  Top 1.27: 33.5,73.69 TR-B14.G
N$29
  Top 1.27: TR-A11.2 33.78,110.54 36.98,110.54 TR-B11.D
  Bottom 1.27: 42.64,110.52 FUSE11.P$1 43.71,111.58
  Bottom 1.778: 42.64,110.52 TR-B11.D | 43.71,111.58 POLYFUSE11.1
N$30
  Top 0.61: OUTPUT1.2 81.71,102.26 PUOR11.1 83.82,102.39 LED11.-
  Bottom 1.27: 63.02,111.58 63.93,110.67 63.95,110.69 FUSE11.P$2 64.36,108.39 | 69.32,102.21 69.28,102.24 FBD11.2 | OUTPUT1.2 75.79,102.26 75.81,102.24 75.92,102.13
  Bottom 1.778: POLYFUSE11.2 63.02,111.58 | 64.36,108.39 67.74,105 67.74,103.78 69.28,102.24 | FBD11.2 75.81,102.24
N$31  (via drill 0.6)
  Top 0.61: v56.9,141.33 63.83,141.33 65.48,142.98 65.48,156.62 68.15,159.28 70.16,159.28 71.5,157.94 71.5,156.92 ICSP.4
  Bottom 0.61: IC1.28 v56.9,141.33
N$32
  Top 0.61: TR-A16.1 | TR-A16.1 37.52,51.05 37.29,50.83 TR-B16.G 42.37,50.83 PDR16.1 | TR-A16.1 28.75,46.25 28.75,39.7 28.07,39.01 24.87,39.01 18.59,45.29 X4.6 8.56,45.29 SER16.2 PUR16.1
N$33  (via drill 0.6)
  Top 0.61: SER1.2 23.24,108.89 23.88,109.53 23.88,111.61 33.66,121.39 37.24,121.39 47.73,131.88 47.73,134.82 v47.88,134.98
  Bottom 0.61: v47.88,134.98 IC1.23
N$34
  Top 0.61: OPTION.2 79.22,156.92 ICSP.1
N$35
  Bottom 0.61: 65.84,129.87 65.66,129.87 | IC1.10 65.84,129.87 | Q21.2 91.97,129.87 65.84,129.87
N$36
  Top 0.61: SERSER.2 SERPDR.1 94.11,148.41 94.11,153.14 92.76,154.48 86.51,154.48 85.32,153.29 85.32,153.34 TR-A111.1
N$37  (via drill 0.6)
  Top 0.61: 60.02,153.19 59.99,153.21 67.46,160.68 72.9,160.68 ISCPRES.1 72.92,160.73 OPTION.1 | 60.02,153.19 57.15,150.32 RESET.2 | 60.02,153.19 62.85,156.02 | 62.85,156.02 63.04,156.21 | v64.03,145.31 62.85,146.49 62.85,156.02
  Bottom 0.61: IC1.1 65.35,141.33 65.35,144.3 64.34,145.31 v64.03,145.31
N$38
  Top 0.61: SERPUR.2 77.44,149.81 SERIAL.2 82.45,149.81 83.57,150.93 85.14,150.93 TR-A111.2 88.16,151.03 89.99,149.2 89.99,139.98 89.36,139.98
N$39
  Bottom 0.61: 65.71,131.17 IC1.9 87.63,131.17 Q21.1
N$40  (via drill 0.6)
  Top 0.61: v57.91,140.06 64.26,140.06 66.73,142.52 66.73,146.33 69.11,148.72 69.11,156.77 ICSP.5
  Bottom 0.61: IC1.27 v57.91,140.06
N$41  (via drill 0.6)
  Top 0.61: C10.1 5.03,154.28 X3.10 15.04,154.28 arc90 SER10.1 arc90 15.88,155.12 PUR10.2 | v15.57,101.85 15.9,101.85 16.59,101.17 U$1.12
  Bottom 0.61: X3.10 8.48,154.28 3.81,149.61 3.81,103.66 6.04,101.42 15.14,101.42 v15.57,101.85
N$43  (via drill 0.6)
  Top 0.61: U$1.10 19.13,101.32 22.45,104.65 22.45,104.67 22.73,104.95 v22.73,105.26 | v21.08,130.45 20.98,130.56 SER5.2
  Bottom 0.61: IC1.4 64.87,137.52 64.14,138.25 64.14,143.41 62.05,145.49 50.44,145.49 44.48,139.52 24.92,139.52 24.03,140.41 21.13,140.41 21.08,140.36 v21.08,130.45 21.08,106.91 v22.73,105.26
N$44  (via drill 0.6)
  Top 0.61: C9.1 4.63,149.2 X3.9 15.55,149.2 arc90 PUR9.2 15.83,152.09 arc-90 SER9.1 | U$1.11 17.86,101.91 18.75,102.79 18.77,102.79 20.09,104.11 20.19,104.11 | 35.28,119.41 35.28,119.43 30.45,114.61 30.45,109.68 27.89,107.11 22.07,107.11 21.26,106.3 21.26,105.18 20.19,104.11 | 35.28,119.41 30.48,114.61 | 20.19,104.11 19.36,103.28 v18.62,103.28 | C6SER.P$1 78.49,138.96 76.33,138.96 73.23,135.87 69.83,135.87 63.73,129.77 v63.73,127.66 | 35.28,119.41 38.23,119.41 v40.87,122.05
  Bottom 0.61: v18.62,103.28 18.36,103.53 6.07,103.53 5.64,103.96 5.64,148.39 6.45,149.2 X3.9 | v63.73,127.66 59.49,123.42 42.24,123.42 v40.87,122.05
N$45
  Top 0.61: U$1.8 20.4,93.55 23.88,93.55 JP1.3
N$46
  Bottom 0.61: 80.59,167.79 80.59,167.84 | 80.59,167.79 79.91,167.79 76.02,163.91 73.53,163.91 73.18,164.26 U$2.3 | 80.59,167.79 80.72,167.79 TC.2
N$47  (via drill 0.6)
  Top 1.016: VR4.1 47.14,162.15 47.3,162 VR3.1 50.24,162 50.27,162.03 50.85,162.03 52.6,163.78 CEXTRA.1
  Top 1.27: v69.11,175.41 69.06,175.46 56.13,175.46 54.41,173.74 54.41,168.12 52.65,166.37 52.65,165.33 CEXTRA.1
  Bottom 1.27: v69.11,175.41 85.45,175.41 87.12,173.74 87.12,164.21 99.19,152.15 POLYFUSE100.2
N$48
  Top 0.61: C2.1 4.7,113.64 X3.2 15.19,113.64 15.5,113.94 SER2.1 | SER2.1 15.8,113.87 | PUR2.2 15.8,111.51 SER2.1
N$49
  Top 0.61: U$1.14 13.99,99.27 13.99,97.38 15.24,96.14 23.5,96.14 | 23.9,96.11 23.9,96.14 23.5,96.14 | JP1.2 23.5,96.11 23.5,96.14
N$50  (via drill 3.2 pad 6.45)
  other vias: 92.33,45.21
N$51
  Top 0.61: C4.1 4.65,123.8 X3.4 14.28,123.8 15.67,125.2 SER4.1 15.83,122.4 PUR4.2
N$52
  Top 0.61: 81.76,86.31 LEDR13.2 | 84.43,76.02 PUOR14.2 76.58,76.02 OUTPUT1.7 | 83.75,52.96 81.15,52.96 | OUTPUT2.9 79.37,12.72 PUOR20.2 81.15,10.95 83.01,10.95 83.03,10.97 LEDR20.2 | OUTPUT2.5 76.05,32.1 PUOR18.2 81.1,32.21 LEDR18.2 | LEDR19.2 81.74,22.89 OUTPUT2.7 | LEDR17.2 PUOR17.2 76.13,42.19 OUTPUT2.3 | PUOR16.2 80.75,53.37 OUTPUT2.1 | OUTPUT1.9 77.65,64.79 PUOR15.2 81.92,64.95 84.33,64.95 | PUOR13.2 76.43,86.33 OUTPUT1.5 | 84.43,96.65 LEDR12.2 | LEDR11.2 84,105.79 PUOR11.2 81.71,107.34 OUTPUT1.1
  Top 1.27: SOURCE.2 96.52,94.69 95.53,93.7 92.41,93.7 91.11,95 91.11,96.72 89.94,97.89 85.67,97.89 84.43,96.65 84.43,95.83 | PUOR14.2 | LEDR14.2 84.43,76.02 | 84.33,64.95 LEDR15.2 | 83.75,52.96 LEDR16.2 | 84.43,95.83 LEDR12.2 | 84.43,95.83 84.33,95.73 | PUOR13.2 81.76,86.31 | 81.15,52.96 PUOR16.2 | LEDR19.2 83.49,21.08 PUOR19.2 | LEDR17.2 | OUTPUT1.3 77.29,95.63 PUOR12.2 LEDR12.2
  Bottom 0.61: 77.07,12.66 FBD20.1 68.81,12.66 FBD19.1 | 69.21,22.89 OUTPUT2.7
  Bottom 0.813: 74.83,97.35 FBD11.1 | 74.83,77.03 FBD13.1 | 69.32,66.7 OUTPUT1.9 | FBD17.1 74.91,33.24 | FBD15.1 OUTPUT2.1 | 69.02,43.2 OUTPUT2.3 | FBD12.1 69.27,87.02 OUTPUT1.5
  Bottom 1.27: 75.84,76.99 75.74,76.89 OUTPUT1.7 | 74.83,77.03 75.8,77.03 75.84,76.99 | 82.4,105.64 81.71,105.64 80.01,107.34 79.96,107.34 | 74.83,97.35 75,97.18 OUTPUT1.3 75.74,97.28 76.1,97.64 | 75.84,76.99 76,76.83 | FBD14.1 69.32,66.7 | FBD18.1 69.16,22.84 69.21,22.89 | 82.3,53.36 82.3,43.1 | 82.28,53.36 82.27,53.37 | FBD15.1 | 69.02,43.2 FBD16.1 | 74.91,33.24 75.12,33.45
  Bottom 1.778: 79.96,107.34 OUTPUT1.1 | 76.1,97.64 82.3,97.64 | 76,76.83 82.3,76.83 | OUTPUT1.9 82.3,66.7 | 82.28,53.36 82.3,53.34 | 74.91,33.24 OUTPUT2.5 | 82.35,16.54 80.95,16.54 | 80.95,16.54 77.07,12.66 77.07,12.72 OUTPUT2.9 | 80.95,16.54 82.3,17.88 | 82.27,53.37 OUTPUT2.1 | 75.12,33.45 82.3,33.45 | 82.3,21.36 82.3,22.89 OUTPUT2.7 | 82.3,43.1 82.3,43.2 OUTPUT2.3 | 82.3,86.64 82.3,87.02 OUTPUT1.5
  Bottom 2.54: 80.82,107.34 79.96,107.34
  Bottom 6.452: 82.4,105.64 82.3,105.54 82.3,97.64 82.3,86.64 82.3,76.83 82.3,66.7 82.3,53.34 82.3,43.1 82.3,33.45 82.3,21.36 82.3,17.88
N$53
  Bottom 0.61: Q22.1 37.13,144.83 37.13,147.06 U$4.2
N$54
  Bottom 0.61: Q22.2 39.98,144.83 39.98,145.99 U$4.1
N$55
  Top 0.61: 95.91,131.93 95.91,131.95 | 95.91,131.93 LEDRESMAIN.1 | LED200.- 95.91,127.38 95.91,131.93
N$56
  Bottom 0.61: U$4.3 36.12,145.62 35.28,144.78 32.61,144.78 BAT1.P$1
N$57  (via drill 0.6)
  Top 0.61: v23.72,132.64 23.67,132.64 20.55,135.76 19.25,135.76 SER6.2
  Bottom 0.61: IC1.22 24.79,133.71 v23.72,132.64
N$58  (via drill 0.6)
  Top 0.61: X4.1 13.82,70.89 13.82,74.35 12.22,75.95 12.19,75.92 SER11.2 7.64,75.95 PUR11/SCK.2 | TR-A11.1 33.98,107.97 | 33.98,107.97 TR-B11.G 41.96,107.97 arc90 PDR11.1 | 33.98,107.97 32.31,107.97 26.87,102.54 23.77,102.54 22.96,101.73 v21.54,101.73
  Bottom 0.61: 13.82,70.89 X4.1 13.84,70.71 12.78,71.78 12.78,82.98 19.51,89.71 19.51,100 21.23,101.73 v21.54,101.73
N$59  (via drill 0.6)
  Top 0.61: SER7.2 19.33,140.77 21.01,140.77 v23.44,138.33
  Bottom 0.61: IC1.24 40.92,136.25 39.22,137.95 23.82,137.95 v23.44,138.33
N$60
  Top 0.61: U$1.13 15.34,99.3 15.34,97.99 15.37,97.97 15.37,97.87 15.9,97.33 21.29,97.33 22.58,98.63 22.58,98.65 JP1.1
N$61
  Top 0.61: C8.1 4.75,144.12 X3.8 arc90 11.1,143.61 PUR8.1 15.67,143.76 15.67,146.56 arc-90 SER8.2
N$62  (via drill 0.6)
  Top 0.61: SER10.2 19.35,154.89 22.12,154.89 28.6,148.41 28.6,132.87 v30.43,131.04
  Bottom 0.61: IC1.18 55.5,128.7 32.77,128.7 v30.43,131.04
N$63
  Top 0.61: 80.03,111.2 80.03,111.53 VR2.1
  Top 0.813: 84.05,111.2 84.18,111.2 | 84.05,111.2 VR1.1 84.51,110.64 CMAIN.1 88.62,110.72 POLYFUSE200.2 | 80.03,111.2 84.05,111.2
N$64
  Top 0.61: LEDR20.1 87.68,10.29 87.68,7.26
  Top 1.27: LED20.+ 87.68,7.26
N$65
  Top 0.61: LEDR19.1 87.78,20.24 87.78,17.73
  Top 1.27: 87.78,17.73 87.73,17.73 LED19.+
N$66
  Top 1.016: LED100.- 39.83,155.47 40.46,156.11 40.46,158.93 40.92,159.38 LEDRESEXTRA.1
N$67
  Top 0.61: LED18.+ 87.61,28.83 87.61,31.47 LEDR18.1
N$68  (via drill 0.6)
  Top 0.61: SER9.2 25.73,145.67 25.73,133.55 25.73,133.27 25.73,128.04 v26.01,127.76
  Bottom 0.61: 55.45,127.23 IC1.17 26.42,127.36 v26.01,127.76
N$69
  Top 0.61: LEDR17.1 88.06,41.3 88.06,38.86
  Top 1.27: LED17.+ 88.06,38.86
N$70
  Top 0.61: LED16.+ 88.11,49.71 88.11,52.04 LEDR16.1
N$71
  Top 0.61: LEDR15.1 88.39,64.29 88.39,61.42
  Top 1.27: LED15.+ 88.39,61.42
N$72
  Top 0.61: LEDR14.1 88.62,75.23 88.62,72.67
  Top 1.27: 88.62,72.67 88.52,72.67 LED14.+
N$73
  Top 0.61: 87.68,86.26 88.39,86.26 88.39,83.03
  Top 1.27: 87.68,86.26 LEDR13.1 | LED13.+ 88.39,83.03
N$74
  Top 0.61: LEDR12.1 88.57,94.89 88.57,92.28
  Top 1.27: LED12.+ 88.57,92.28
N$75
  Top 0.61: LED11.+ 87.48,102.62 87.38,102.62 87.38,104.65 87.4,104.67 LEDR11.1
N$76
  Top 0.61: PUR12.2 7.72,69.88 SER12.2 8.2,69.9 12.45,65.66 13.56,65.66 X4.2 13.66,65.56 15.37,65.56 24.77,74.95 24.77,78.66 30.5,84.4 30.5,95.71 31.57,96.77 TR-A12.1 36.78,96.77 TR-B12.G 42.03,96.55 PDR12.1
N$77
  Top 0.61: C3.1 4.8,118.72 X3.3 14.89,118.72 15.65,119.48 SER3.1 PUR3.2
N$78
  Top 0.61: PUR19/SDO.1 4.22,25.4 SER19.2 9.2,25.4 X4.9 19.74,30.05 26.72,23.06 28.19,23.06 29.92,21.34 29.92,18.69 31.04,17.58 32.97,17.58 TR-A19.1 36.55,16.99 TR-B19.G 42.03,16.54 PDR19.1
N$79
  Top 0.61: X4.10 11.58,24.97 9.17,22.55 SER20.2 | PDR20.1 42.01,5.11 TR-B20.G 36.78,5.33 TR-A20.1 33.43,4.93 20.8,4.93 16.05,9.68 16.05,12.55 11.12,17.48 6.5,17.48 6.12,17.86 6.12,22.45 6.38,22.71 | 7.11,22.5 7.93,22.5 SER20.2 | PUR20/SDI.1 6.38,22.71 | 6.38,22.71 7.82,22.71 SER20.2
N$80
  Top 0.61: U$1.5 16.59,90.45 RC2.2
N$81
  Top 0.61: 13.92,87.1 13.79,86.97 | RC1.2 13.92,87.1 | U$1.3 14.05,87.22 13.92,87.1
N$82
  Top 0.61: U$1.4 15.32,89.74 15.98,89.08 15.98,86.97 16.99,85.95 18.29,85.95 RC2.1 17.93,85.85 17.78,86 18.92,86 19.13,85.8
N$83
  Top 0.61: RC1.1 11.51,87.71 U$1.1
N$84
  Top 0.61: RS232PWR.3 16.33,77.95 16.33,81.61 13.66,84.28 9.65,84.28 7.57,86.36 7.57,95.12 | 7.57,95.12 7.57,95.3 | 7.57,95.12 RC4.1 8.43,95.07 9.42,96.06 12.72,96.06 12.85,95.94 12.85,94.2 U$1.2
N$85
  Top 0.61: U$1.6 17.86,91.85 19.28,90.42 20.24,90.42 20.88,89.79 20.88,84.25 18.85,82.22 18.85,81.03 RC5.2 | 18.85,80.87 18.85,80.85 | RC5.2 18.85,80.87 | 18.85,80.87 18.92,80.95 | RS232PWR.2 19,77.78 18.97,77.78 18.97,80.74 RC5.2
N$87
  Top 0.61: C5.1 4.68,128.88 X3.5 14.68,128.88 15.67,127.89 PUR5.2 15.8,130.53 SER5.1
N$89
  Top 0.61: C1.1 4.7,108.56 X3.1 10.92,108.89 SER1.1 15.78,106.3 PUR1.2
N$90  (via drill 0.6)
  Top 0.61: SER11.1 9.37,77.62 12.95,77.62 15.77,74.8 22.2,74.8 23.39,76 23.39,79.78 28.68,85.06 28.68,99.67 34.7,105.69 39.17,105.69 v39.19,105.72
  Bottom 0.61: v39.19,105.72 48.06,105.72 52.43,110.08 52.43,113.44 54.36,115.37 65.94,115.37 | U$2.5 74.49,161.62 83.77,161.62 96.67,148.72 96.67,123.8 92.79,119.91 78.13,119.91 73.58,115.37 65.94,115.37 | IC1.14 65.94,124.74 65.94,115.37
N$93  (via drill 0.6)
  Top 0.61: v9.25,74.04 8.48,74.04 SER12.1
  Bottom 0.61: IC1.13 63.8,126.09 59.74,122.02 43.03,122.02 41.05,120.04 31.62,120.04 24.46,112.88 24.46,104.75 22.96,103.25 20.8,103.25 17.02,99.47 17.02,90.65 10.54,84.18 10.54,75.34 v9.25,74.04
N$94  (via drill 0.6)
  Top 0.61: 70.54,120.75 v70.56,120.73 63.3,113.46 63.3,81.1 v63.22,81.03 | v36.27,82.91 32.16,82.91 28.65,79.4 28.65,73.94 27.84,73.13 25.45,73.13 15.57,63.25 11.51,63.25 8.08,66.67 SER13.1
  Bottom 0.61: IC1.12 65.94,127.43 67.79,127.43 67.79,123.39 70.54,120.65 70.56,120.67 v70.56,120.73 | v63.22,81.03 63.22,81.15 62.13,82.25 36.93,82.25 v36.27,82.91
N$95  (via drill 0.6)
  Top 0.61: SER4.2 26.29,125.2 30.45,129.36 37.24,129.36 47.17,139.29 v47.17,139.68
  Bottom 0.61: U$2.6 73.18,160.32 74.07,159.44 81.94,159.44 88.88,152.5 88.88,134.75 86.89,132.77 76.22,132.77 72.75,136.25 IC1.5 65.79,136.32 64.21,136.32 62.64,137.9 62.64,142.72 61.04,144.32 52.4,144.32 47.75,139.68 v47.17,139.68
N$97  (via drill 0.6)
  Top 0.61: SER3.2 19.66,119.05 23.19,119.05 30.12,125.98 35.97,125.98 v52.43,142.44
  Bottom 0.61: 65.84,134.95 IC1.6 63.86,134.98 61.44,137.39 61.44,142.37 60.83,142.98 52.96,142.98 v52.43,142.44
N$98  (via drill 0.6)
  Top 0.61: 77.17,126.9 77.24,126.97 | 77.17,126.9 v77.11,126.9 | 77.17,126.9 76.56,126.29 76.56,123.34 69.37,116.15 69.37,75.79 63.6,70.03 v63.7,70.03 | SER14.1 9.52,58.17 16.59,58.17 17.98,59.56 17.98,61.7 26.72,70.43 28.68,70.43 30.2,71.96 39.19,71.96 v39.65,72.42
  Bottom 0.61: v63.7,70.03 40.46,70.03 39.9,70.59 39.9,72.16 v39.65,72.42 | IC1.11 75.39,128.63 v77.11,126.9
N$99  (via drill 0.6)
  Top 0.61: U$24.P$2 72.62,137.54 68.81,137.54 67.59,136.32 60.12,136.32 v59.99,136.19 | v51.16,137.52 51.16,60.94 49.07,58.85 26.49,58.85 15.29,47.65 SER16.1
  Bottom 0.61: v51.16,137.52 IC1.25 58.67,137.52 v59.99,136.19
N$101  (via drill 0.6)
  Top 0.61: v52.22,138.79 52.07,138.94 50.75,138.94 49.91,138.1 49.91,116.61 46.05,112.75 45.9,112.75 45.9,69.24 45.74,69.09 32.82,69.09 29.01,65.28 29.01,62.87 28.12,61.98 24.59,61.98 16.1,53.49 11.2,53.49 10.82,53.87 SER15.1
  Bottom 0.61: v52.22,138.79 IC1.26
N$104
  Top 0.61: 86.13,143 U$24.P$1 81.03,142.6 C6SER.P$2 | 86.13,143 87.91,143 SERSER.1 | 87.83,139.98 86.13,139.98 86.13,143
N$107  (via drill 0.6)
  Top 0.61: C6.1 X3.6 14.79,133.96 PUR6.2 15.83,135.61 15.75,135.69 15.78,135.69 SER6.1 | U$18.6 41.4,150.55 v40.23,149.38
  Bottom 0.61: U$4.6 36.12,150.11 36.47,149.76 38.63,149.76 39.61,148.78 | 39.61,148.78 41.96,146.43 41.96,144.25 40.64,142.93 29.18,142.93 22.07,150.04 21.08,150.04 18.44,147.4 18.44,140.82 11.58,133.96 X3.6 | v40.23,149.38 40.21,149.38 39.61,148.78
N$111  (via drill 0.6)
  Top 0.61: C7.1 4.75,139.04 X3.7 14.99,139.04 arc-90 PUR7.2 | 15.75,138.28 arc90 PUR7.2 | U$18.5 43.73,151.74 34.67,151.74 v33.66,150.72 28.88,150.72 v24.46,155.14 | SER7.1 PUR7.2
  Bottom 0.61: 34.74,152.4 U$4.5 34.85,151.92 v33.66,150.72 | v24.46,155.14 22.45,155.14 15.57,148.26 15.57,141.45 13.16,139.04 X3.7
SER18  (via drill 0.6)
  Top 0.61: U$1.9 20.4,99.42 20.37,99.44 20.4,99.44 | 20.68,99.6 U$1.9 | U$1.9 20.61,99.32 v21.08,99.8 | SER18.1 9.04,34.8 11.73,37.49 v17.04,37.49 | v62,120.88 62,131.39 58.6,134.8 58.6,137.19 59.82,138.41 67.51,138.41 70.99,141.88 IN/OUT/OW.2
  Bottom 0.61: IC1.3 70.99,138.79 IN/OUT/OW.2 | v17.04,37.49 17.3,37.74 17.3,72.69 17.17,72.69 14.83,75.03 14.83,75.06 14.25,75.64 14.25,80.57 21.08,87.4 v21.08,99.8 21.69,99.8 26.01,104.11 26.01,112.29 30.81,117.09 58.22,117.09 v62,120.88
(copper drawn outside any net)
  shapes: Bottom area x4

## Text on the board
tPlace: + | - | + | - | - | + | \\ / \\ / | ALT5V | +18V | - | + | General I/O Rev 4 feb 2022 Dan Jubenville
bPlace: + | - | + | - | - | + | \\ / \\ / | ALT5V | +18V | - | + | General I/O Rev 4 Feb 2022 Dan Jubenville
tNames: 5V to / ALT 5V | B4SER | SERINV | C6SER